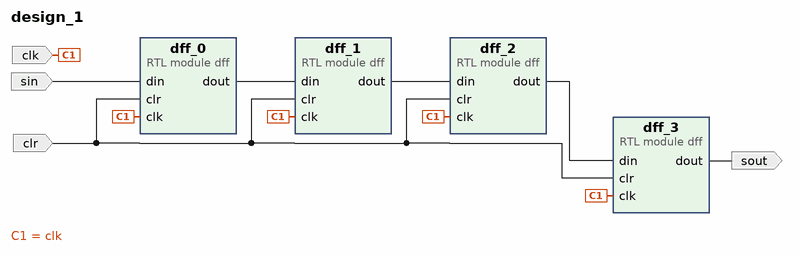
[diagram p0: block diagram of the top level]
# Vivado block design design_1, xc7a100tcsg324-1, Vivado 2024.2
create_bd_design design_1

create_bd_port -dir O sout
create_bd_port -dir I -type clk clk
create_bd_port -dir I clr
create_bd_port -dir I sin

create_bd_cell -type module -reference dff dff_0
create_bd_cell -type module -reference dff dff_1
create_bd_cell -type module -reference dff dff_2
create_bd_cell -type module -reference dff dff_3

# ---- connections ----

connect_bd_net -net clk_0_1 [get_bd_ports clk] [get_bd_pins dff_0/clk] [get_bd_pins dff_1/clk] [get_bd_pins dff_2/clk] [get_bd_pins dff_3/clk]
connect_bd_net -net clr_0_1 [get_bd_ports clr] [get_bd_pins dff_0/clr] [get_bd_pins dff_1/clr] [get_bd_pins dff_2/clr] [get_bd_pins dff_3/clr]
connect_bd_net [get_bd_pins dff_0/dout] [get_bd_pins dff_1/din]
connect_bd_net [get_bd_pins dff_1/dout] [get_bd_pins dff_2/din]
connect_bd_net [get_bd_pins dff_2/dout] [get_bd_pins dff_3/din]
connect_bd_net [get_bd_pins dff_3/dout] [get_bd_ports sout]
connect_bd_net -net din_0_1 [get_bd_ports sin] [get_bd_pins dff_0/din]

validate_bd_design
save_bd_design
